# EAGLE design umodular_fader8 (EAGLE 7.2.0)
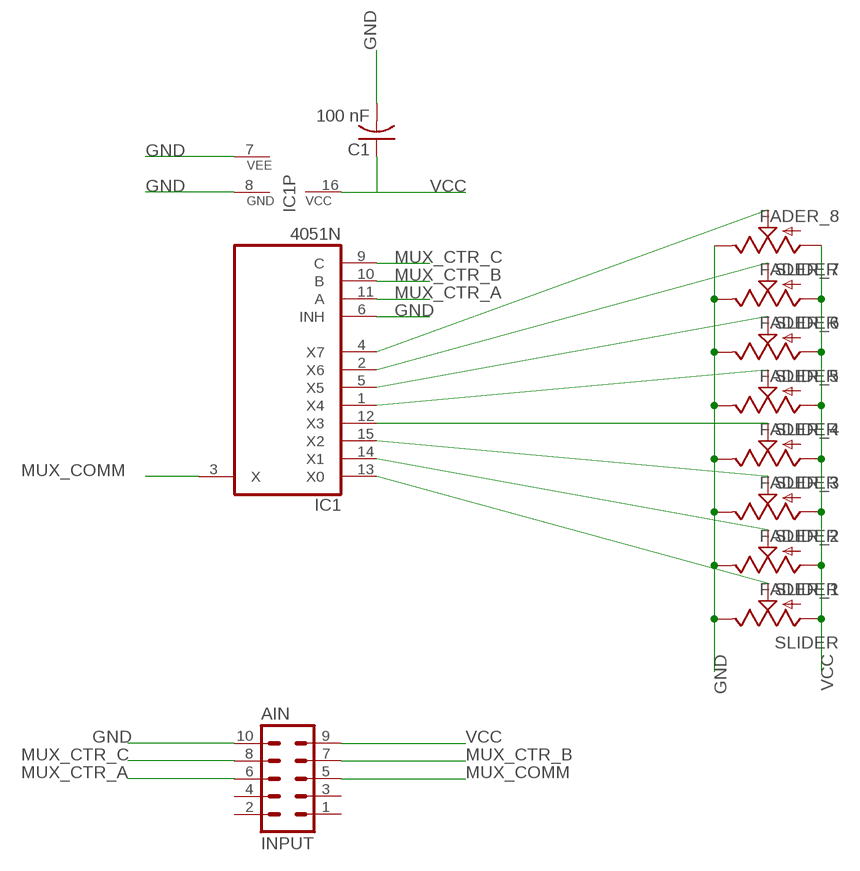
[diagram p0: schematic, sheet 1]

## Parts
AIN  INPUT  MA05-2  [MA05-2]
C1  100 nF  C-US050-024X044  [C050-024X044]
FADER_1  SLIDER  [SLIDER]
FADER_2  SLIDER  [SLIDER]
FADER_3  SLIDER  [SLIDER]
FADER_4  SLIDER  [SLIDER]
FADER_5  SLIDER  [SLIDER]
FADER_6  SLIDER  [SLIDER]
FADER_7  SLIDER  [SLIDER]
FADER_8  SLIDER  [SLIDER]
IC1  4051N  [DIL16]

## Nets
GND: AIN.10 C1.2 FADER_1.1(E) FADER_2.1(E) FADER_3.1(E) FADER_4.1(E) FADER_5.1(E) FADER_6.1(E) FADER_7.1(E) FADER_8.1(E) IC1.6(INH) IC1.7(VEE) IC1.8(GND)
MUX_COMM: AIN.5 IC1.3(X)
MUX_CTR_A: AIN.6 IC1.11(A)
MUX_CTR_B: AIN.7 IC1.10(B)
MUX_CTR_C: AIN.8 IC1.9(C)
N$274: FADER_1.2A(S) IC1.13(X0)
N$275: FADER_2.2A(S) IC1.14(X1)
N$276: FADER_3.2A(S) IC1.15(X2)
N$277: FADER_4.2A(S) IC1.12(X3)
N$278: FADER_5.2A(S) IC1.1(X4)
N$279: FADER_6.2A(S) IC1.5(X5)
N$280: FADER_7.2A(S) IC1.2(X6)
N$281: FADER_8.2A(S) IC1.4(X7)
VCC: AIN.9 C1.1 FADER_1.3(A) FADER_2.3(A) FADER_3.3(A) FADER_4.3(A) FADER_5.3(A) FADER_6.3(A) FADER_7.3(A) FADER_8.3(A) IC1.16(VCC)
Unconnected: AIN.1 AIN.2 AIN.3 AIN.4

## Library data of the parts
AIN = con-lstb:MA05-2: PIN HEADER; OC_FARNELL: unknown; OC_NEWARK: unknown
C1 = rcl:C-US: CAPACITOR, American symbol
FADER_1-FADER_8 = slider60mm:SLIDER: Slide-type potentiometer- COM-9119
IC1 = 40xx:4051: 8-channel ANALOG MULTIPLEXER

## Board
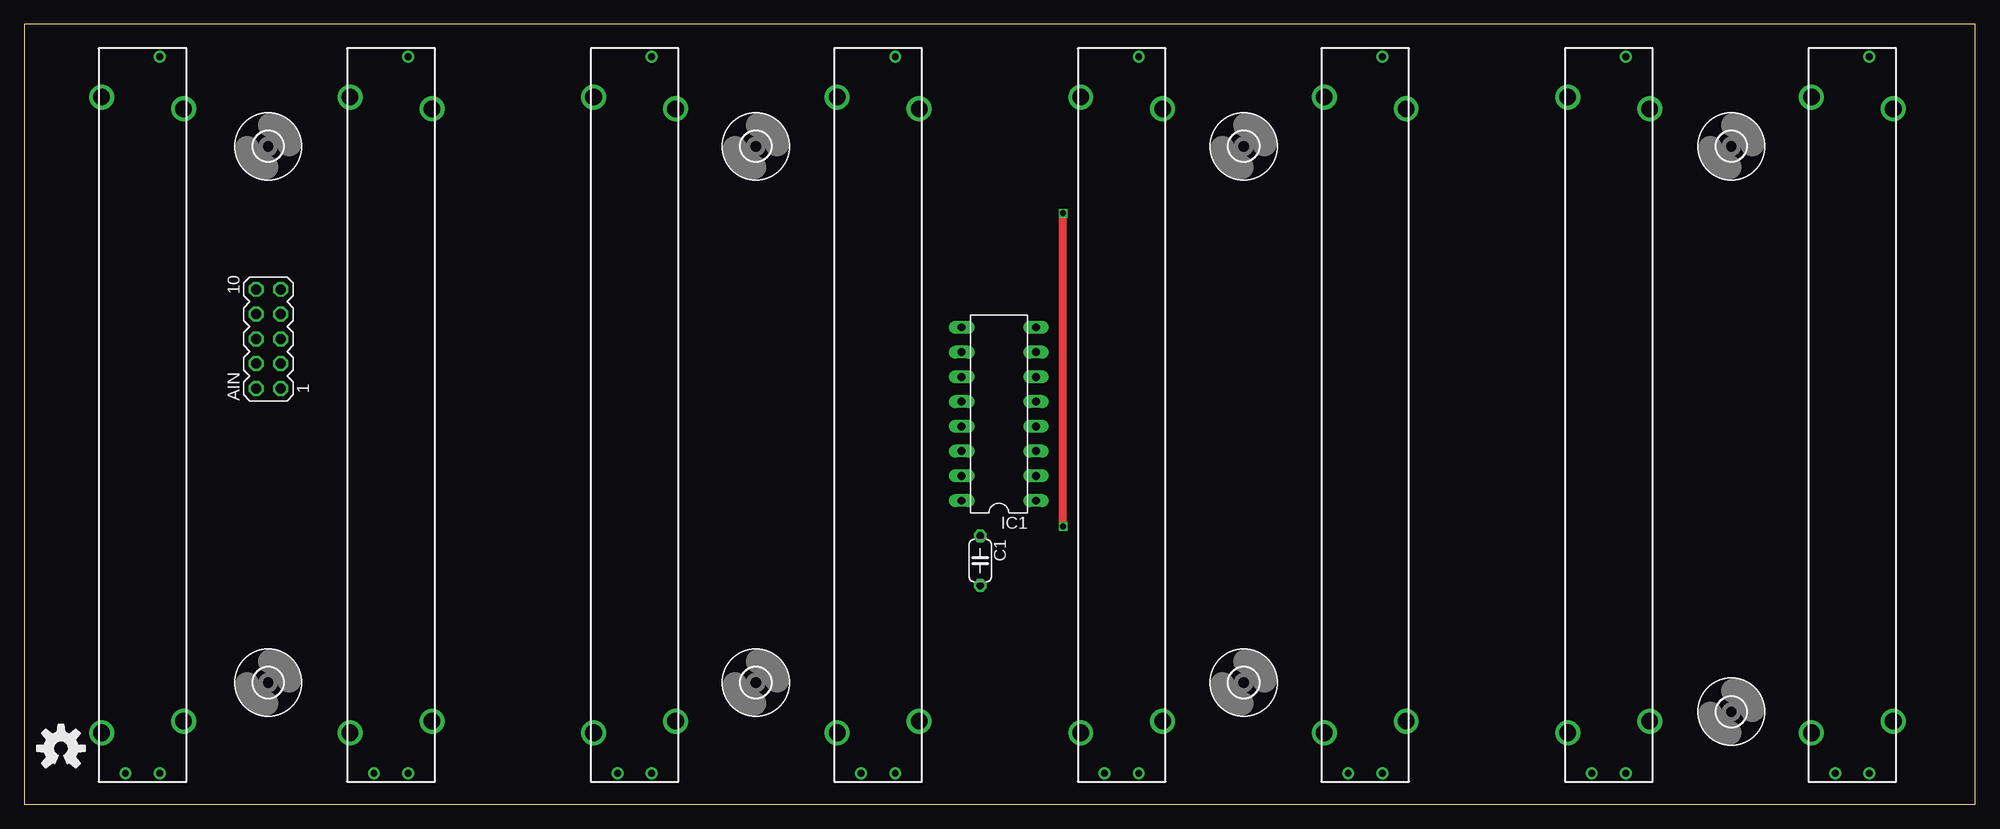
[diagram p1: board, top side]
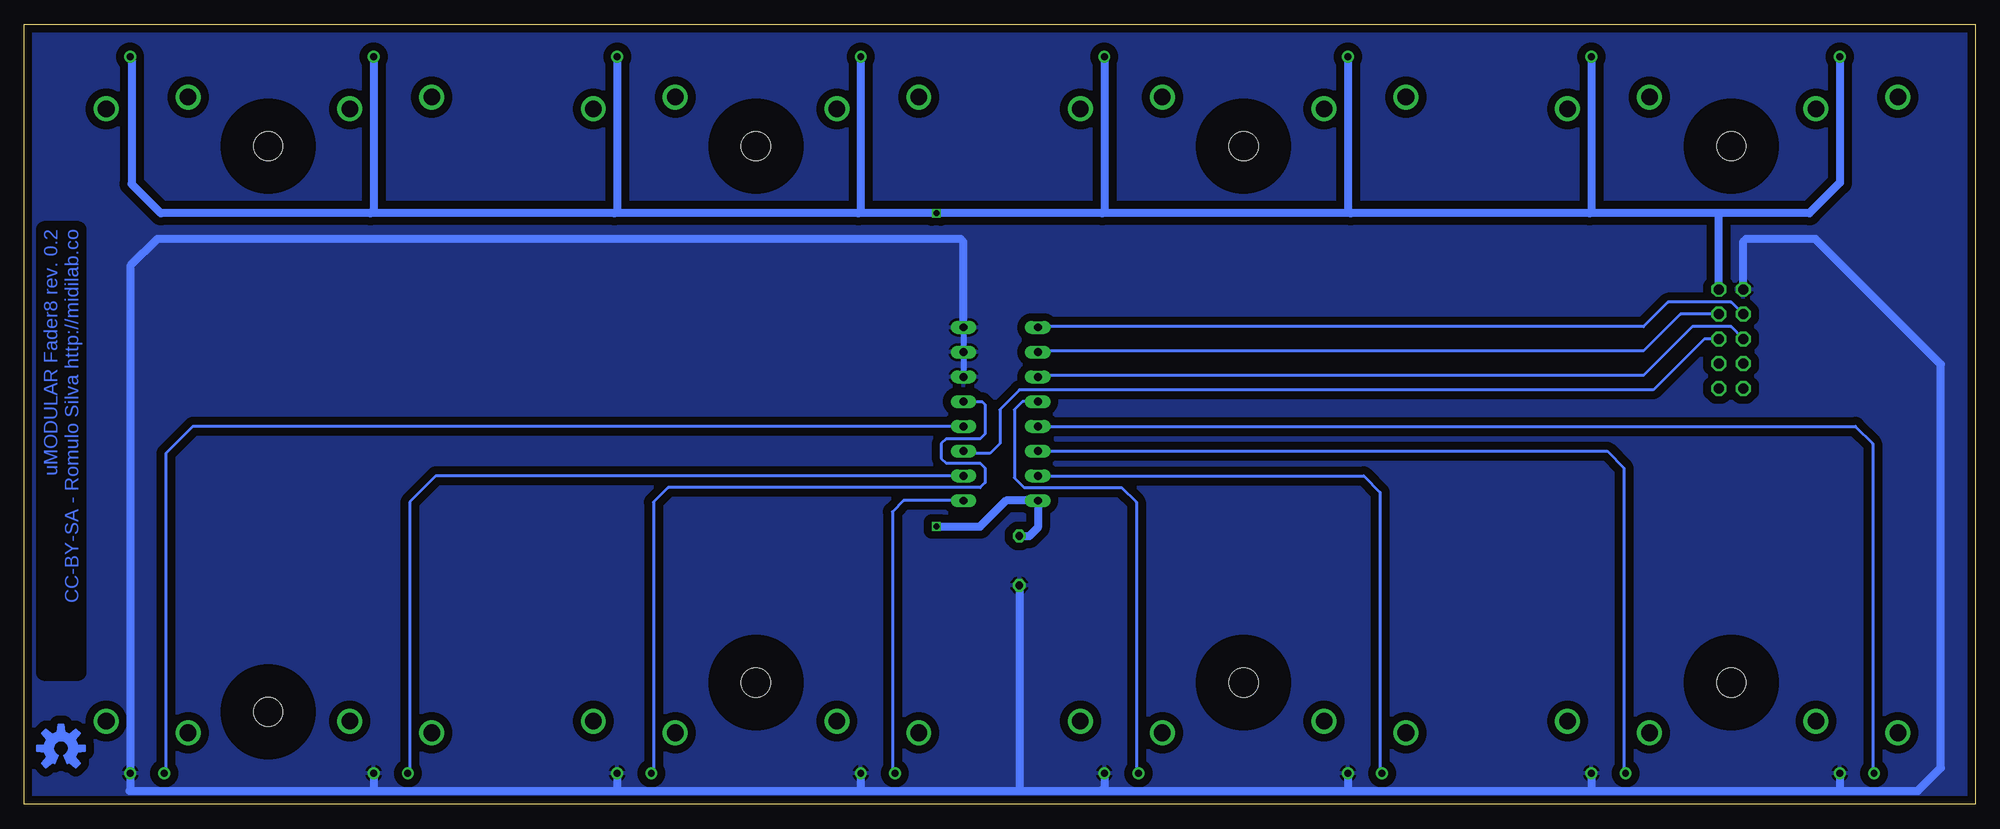
[diagram p2: board, bottom side, seen from below]

Size 200 x 80 mm. Coordinates in mm from the lower left corner, seen from the top.
Outline: 0,0 200,0 200,80 0,80 0,0
Copper layers (1*16): Top 0.035mm / dielectric 1.5mm / Bottom 0.035mm
Design rules "SeeedStudio_2layer_DRU_no_angle_20140221": minimum track width 6mil, minimum drill 12mil, track to track 6mil, track to pad 6mil, pad to pad 6mil, via to via 6mil, smd to smd 0mil, copper to edge 10mil, drill to drill 10mil, minimum pad ring 10mil, minimum via ring 6mil, stop-mask expansion 2mil, vias tented up to drill 100mil, thermal gap 10mil

### Footprints (pad centres in the part's own frame; a part is rotated, then mirrored left to right if it is on the bottom)
MA05-2 = drill 1.016 octagon: 1 -5.08,-1.27; 2 -5.08,1.27; 3 -2.54,-1.27; 4 -2.54,1.27; 5 0,-1.27; 6 0,1.27; 7 2.54,-1.27; 8 2.54,1.27; 9 5.08,-1.27; 10 5.08,1.27
C050-024X044 = drill 0.813 octagon: 1 -2.54,0; 2 2.54,0
SLIDER = drill 0.7 pad 1.016: 1 -36.75,-1.75; 2A -36.75,1.75; 3 36.75,-1.75 | drill 1.7 pad 2.184: SUPPORT -32.6,4.2; SUPPORT1 -31.4,-4.2; SUPPORT2 31.4,-4.2; SUPPORT3 32.6,4.2
DIL16 = drill 0.813 long: 1 -8.89,-3.81; 2 -6.35,-3.81; 3 -3.81,-3.81; 4 -1.27,-3.81; 5 1.27,-3.81; 6 3.81,-3.81; 7 6.35,-3.81; 8 8.89,-3.81; 9 8.89,3.81; 10 6.35,3.81; 11 3.81,3.81; 12 1.27,3.81; 13 -1.27,3.81; 14 -3.81,3.81; 15 -6.35,3.81; 16 -8.89,3.81
3,0 = hole 3: 0,0

### Placement (x,y rotation side)
AIN  25.02,47.74 90 top
C1  98,25 270 top
FADER_1  12.12,39.94 90 top
FADER_2  37.59,39.94 90 top
FADER_3  62.56,39.94 90 top
FADER_4  87.53,39.94 90 top
FADER_5  112.5,39.94 90 top
FADER_6  137.47,39.94 90 top
FADER_7  162.44,39.94 90 top
FADER_8  187.41,39.94 90 top
IC1  99.91,40.04 90 top
U$1  [3,0]  25,67.5 0 top
U$2  [3,0]  25,12.5 0 top
U$3  [3,0]  175,67.5 0 top
U$4  [3,0]  175,9.5 0 top
U$5  [3,0]  75,67.5 0 top
U$6  [3,0]  75,12.5 0 top
U$7  [3,0]  125,67.5 0 top
U$8  [3,0]  125,12.5 0 top
U$9  [OSHW-LOGO-M]  3.75,5.75 0 top
U$10  [OSHW-LOGO-M]  196.25,5.75 0 top

### Tracks (layer width: path | path; a pad name or v marks a point on that pad's centre or on a via)
GND
  Bottom 0.61: IC1.8 IC1.7 IC1.6
  Bottom 0.813: AIN.10 23.75,57.75 23.5,58 16.38,58 3.5,45.12 3.5,3.75 5.88,1.38 13.88,1.38 | IC1.8 103.72,57.72 104,58 186.38,58 189.12,55.25 189.12,3.23 FADER_8.1 189.16,1.47 189.25,1.38 164.25,1.38 | 164.25,1.38 139.25,1.38 | 139.25,1.38 114.38,1.38 | 114.38,1.38 98.12,1.38 | 98.12,1.38 89.62,1.38 | 89.62,1.38 64.38,1.38 | 64.38,1.38 39.38,1.38 | 39.38,1.38 13.88,1.38 | FADER_1.1 13.87,1.38 13.88,1.38 | FADER_2.1 39.34,1.41 39.38,1.38 | FADER_3.1 64.31,1.44 64.38,1.38 | FADER_4.1 89.28,1.72 89.62,1.38 | C1.2 98,1.5 98.12,1.38 | FADER_5.1 114.25,1.5 114.38,1.38 | FADER_6.1 139.22,1.41 139.25,1.38 | FADER_7.1 164.19,1.44 164.25,1.38
  pour Bottom (isolate 0.813): 0.25,79.75 199.75,79.75 199.75,0.25 0.25,0.25 0.25,79.62
MUX_COMM
  Bottom 0.305: IC1.3 103.49,36 101,36 100,37 100,40.5 98,42.5 33,42.5 27.76,47.74 AIN.5
MUX_CTR_A
  Bottom 0.305: AIN.6 25,49 29,49 34,44 95.95,44 IC1.11
MUX_CTR_B
  Bottom 0.305: AIN.7 30.22,50.28 34,46.5 95.99,46.5 IC1.10
MUX_CTR_C
  Bottom 0.305: AIN.8 23.78,50.28 25,51.5 31.5,51.5 34,49 96.03,49 IC1.9
N$274
  Bottom 0.305: IC1.13 12.27,38.77 10.5,37 10.5,3.32 FADER_1.2A
N$275
  Bottom 0.305: IC1.14 37.73,36.23 36,34.5 36,3.35 FADER_2.2A
N$276
  Bottom 0.305: IC1.15 62.69,33.69 61,32 61,3.38 FADER_3.2A
N$277
  Bottom 0.305: IC1.12 97.69,41.31 98.5,40.5 98.5,33.5 97.5,32.5 87.5,32.5 86,31 86,3.41 FADER_4.2A
N$278
  Bottom 0.305: IC1.1 109.85,31.15 111,30 111,3.44 FADER_5.2A
N$279
  Bottom 0.305: IC1.5 101.81,41.31 101.5,41 101.5,38 102,37.5 105.5,37.5 106,37 106,35.5 105.5,35 102,35 101.5,34.5 101.5,33 102,32.5 134,32.5 135.5,31 135.5,3.41 FADER_6.2A
N$280
  Bottom 0.305: IC1.2 157.81,33.69 160.5,31 160.5,3.38 FADER_7.2A
N$281
  Bottom 0.305: IC1.4 182.73,38.77 185.5,36 185.5,3.35 FADER_8.2A
VCC  (via drill 0.6)
  Top 0.813: v106.5,28.5 v106.5,60.62
  Bottom 0.813: AIN.9 26.29,60.41 26.5,60.62 | 26.5,60.62 17,60.62 13.87,63.76 FADER_1.3 | 26.5,60.62 39.5,60.62 | 39.5,60.62 64,60.62 | 64,60.62 89.5,60.62 | 89.5,60.62 v106.5,60.62 114.5,60.62 | 114.5,60.62 139.5,60.62 | 139.5,60.62 164.5,60.62 | FADER_2.3 39.34,60.78 39.5,60.62 | FADER_3.3 64.31,60.94 64,60.62 | FADER_4.3 89.28,60.84 89.5,60.62 | FADER_5.3 114.25,60.88 114.5,60.62 | FADER_6.3 139.22,60.91 139.5,60.62 | FADER_7.3 164.19,60.94 164.5,60.62 | FADER_8.3 189,76.35 189,63.62 186,60.62 164.5,60.62 | v106.5,28.5 102,28.5 99.35,31.15 IC1.16 96.1,28.4 97,27.5 97.96,27.5 C1.1

### Text on the board
Bottom: uMODULAR Fader8 rev. 0.2 / CC-BY-SA - Romulo Silva http://midilab.co
tValues: uMODULAR Fader8 rev. 0.2 / CC-BY-SA - Romulo Silva http://midilab.co